# Altium schematic sheet concentrador.SchDoc: Diagrama_Concentrador V2.0
size A3; Date: 27/11/2018; DrawnBy: Franklin Placencia; Organization: Miviltech; SheetNumber: 1; PageSetup: Record=PageOptions|CenterHorizontal=True|CenterVertical=True|PrintScale=0.71|XCorrection=1.00|YCorrection=1.00|PrintKind=0|BorderSize=5000000|LeftOffset=0|BottomOffset=0|Orientation=2|PaperLength=1000|PaperWidth=1000|Scale=100|PaperSource=7|PrintQuality=-3|MediaType=1|DitherType=10|PrintScaleMode=1|PaperKind=A4 (210 x 297 mm)|PaperIndex=9
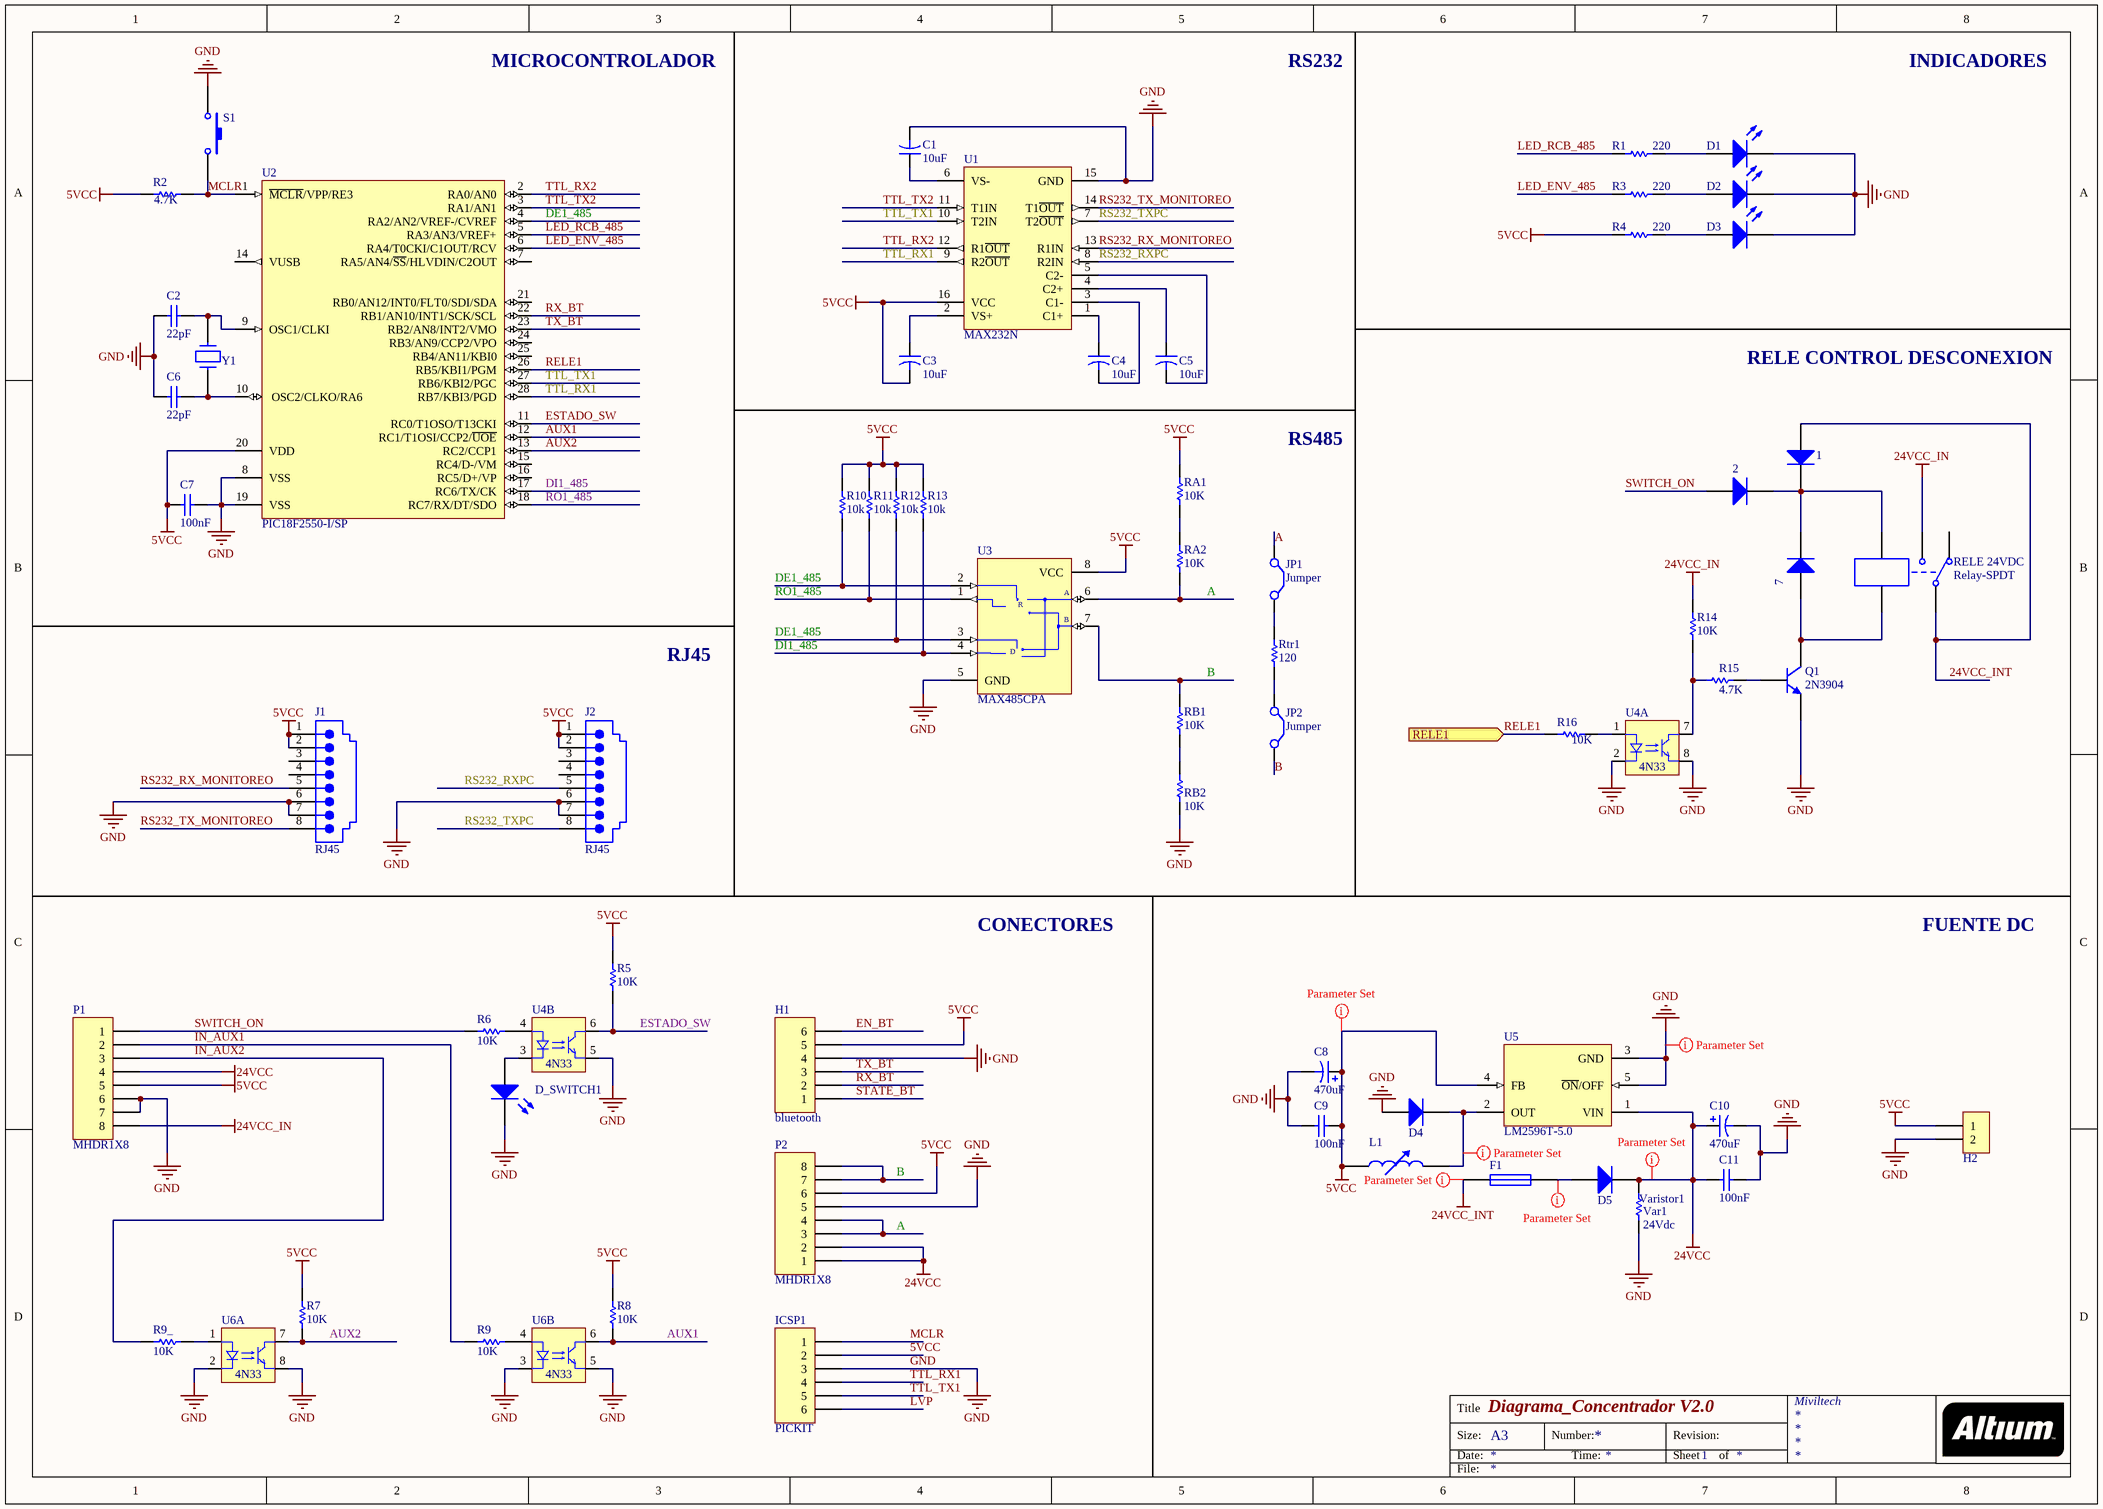
[diagram p0: concentrador.SchDoc]

## Parts
1  Diode 1N4001  [DIODE-0.3A]  (value not drawn)
2  Diode 1N4001  [DIODE-0.3A]  (value not drawn)
7  Diode 1N4001  [DIODE-0.3A]  (value not drawn)
C1  value 10uF  [C1UF]  (hidden comment: Cap2)
C2  value 22pF  [VP31-2.5]  (hidden comment: VP31BA220JB)
C3  value 10uF  [C1UF]  (hidden comment: Cap2)
C4  value 10uF  [C1UF]  (hidden comment: Cap2)
C5  value 10uF  [C1UF]  (hidden comment: Cap2)
C6  value 22pF  [VP31-2.5]  (hidden comment: VP31BA220JB)
C7  value 100nF  [VP44-2.5]  (hidden comment: VP44BY224JB)
C8  value 470uF  [C1000UF]  (hidden comment: Cap Pol1)
C9  value 100nF  [VP44-2.5]  (hidden comment: VP44BY224JB)
C10  value 470uF  [C1000UF]  (hidden comment: Cap Pol1)
C11  value 100nF  [VP44-2.5]  (hidden comment: VP44BY224JB)
D1  LED0  [LED3MM green]  (value not drawn)
D2  LED0  [LED3MM green]  (value not drawn)
D3  LED0  [LED3MM green]  (value not drawn)
D4  Diodo  [1N4000]  (value not drawn)
D5  Diodo  [1N4000]  (value not drawn)
D_SWITCH1  LED0  [LED3MM green]  (value not drawn)
F1  Fuse  [PORTA_FUSE]  (value not drawn)
H1  bluetooth  [Header 1X6]
H2  Header  [Header 1X2]  (value not drawn)
ICSP1  PICKIT  [HDR1X6]
J1  RJ45  [15-43-6233]
J2  RJ45  [15-43-6233]
JP1  Jumper  [RAD-0.2]
JP2  Jumper  [RAD-0.2]
L1  Inductor Adj  [Inductor_redondo]  (value not drawn)
P1  MHDR1X8  [8PEQ_TAIYUE_OK]
P2  MHDR1X8  [8PEQ_TAIYUE_OK]
Q1  2N3904  [2N3904_OK]
R1  value 220  [AXIAL-0.3]  (hidden comment: Res1)
R2  value 4.7K  [AXIAL-0.3]  (hidden comment: Res1)
R3  value 220  [AXIAL-0.3]  (hidden comment: Res1)
R4  value 220  [AXIAL-0.3]  (hidden comment: Res1)
R5  value 10K  [AXIAL-0.3]  (hidden comment: Res1)
R6  value 10K  [AXIAL-0.3]  (hidden comment: Res1)
R7  value 10K  [AXIAL-0.3]  (hidden comment: Res1)
R8  value 10K  [AXIAL-0.3]  (hidden comment: Res1)
R9  value 10K  [AXIAL-0.3]  (hidden comment: Res1)
R9_  value 10K  [AXIAL-0.3]  (hidden comment: Res1)
R10  value 10k  [AXIAL-0.3]  (hidden comment: Res1)
R11  value 10k  [AXIAL-0.3]  (hidden comment: Res1)
R12  value 10k  [AXIAL-0.3]  (hidden comment: Res1)
R13  value 10k  [AXIAL-0.3]  (hidden comment: Res1)
R14  value 10K  [AXIAL-0.3]  (hidden comment: Res1)
R15  value 4.7K  [AXIAL-0.3]  (hidden comment: Res1)
R16  value 10K  [AXIAL-0.3]  (hidden comment: Res1)
RA1  value 10K  [AXIAL-0.3]  (hidden comment: Res1)
RA2  value 10K  [AXIAL-0.3]  (hidden comment: Res1)
RB1  value 10K  [AXIAL-0.3]  (hidden comment: Res1)
RB2  value 10K  [AXIAL-0.3]  (hidden comment: Res1)
RELE_24VDC  Relay-SPDT  [MODULE5B]
Rtr1  value 120  [AXIAL-0.3]  (hidden comment: Res1)
S1  Push Button  [PULSA4]  (value not drawn)
U1  MAX232N  [N016]
U2  PIC18F2550-I/SP  [SPDIP300-SP28]
U3  MAX485CPA  [PA8]
U4  4N33  [4n35_4n33_6pines]  (parts A,B of 2)
U5  LM2596T-5.0  [FP_LM2596_D_PCB]
U6  4N33  [4n35_4n33_6pines]  (parts A,B of 2)
Varistor1  Var1  value 24Vdc  [AXIAL-0.3]
Y1  XTAL  [Cristal mini]  (value not drawn)

## Ports
RELE1 (in)

## Nets
5VCC: C3.2 C7.1 C8.1 C9.2 H1.5 H2.1 ICSP1.2 J1.1 J1.2 J2.1 J2.2 L1.1 P1.5 P2.6 R2.1 R4.1 R5.1 R7.1 R8.1 R10.2 R11.2 R12.2 R13.2 RA1.1 U1.16(VCC) U2.20(VDD) U3.8(VCC) U5.4(FB)
24VCC: C10.1 C11.1 D5.2(K) P1.4 P2.1 P2.2 U5.1(VIN) Varistor1.2
24VCC_IN: P1.8 R14.1 RELE_24VDC.3
24VCC_INT: 1.1(A) F1.2 RELE_24VDC.1
GND: C1.2 C2.2 C6.2 C7.2 C8.2 C9.1 C10.2 C11.2 D1.2(K) D2.2(K) D3.2(K) D4.1(A) D_SWITCH1.2(K) H1.4 H2.2 ICSP1.3 J1.6 J1.7 J2.6 J2.7 P1.6 P1.7 P2.5 Q1.1(E) RB2.1 S1.1 U1.15(GND) U2.8(VSS) U2.19(VSS) U3.5(GND) U4.2(K) U4.5(E) U4.8(E) U5.3(GND) U5.5(~{ON}/OFF) U6.2(K) U6.3(K) U6.5(E) U6.8(E) Varistor1.1
A: JP1.1(C1) P2.3 P2.4 RA2.1 U3.6(A)
AUX1: R8.2 U2.12(RC1/T1OSI/CCP2/~{UOE}) U6.6(C)
AUX2: R7.2 U2.13(RC2/CCP1) U6.7(C)
B: JP2.2(C2) P2.7 P2.8 RB1.1 U3.7(B)
DE1_485: R10.1 R12.1 U2.4(RA2/AN2/VREF-/CVREF) U3.2(~{RE}) U3.3(DE)
DI1_485: R13.1 U2.17(RC6/TX/CK) U3.4(DI)
EN_BT: H1.6
ESTADO_SW: R5.2 U2.11(RC0/T1OSO/T13CKI) U4.6(C)
IN_AUX1: P1.2 R9.2
IN_AUX2: P1.3 R9_.2
LED_ENV_485: R3.1 U2.6(RA4/T0CKI/C1OUT/RCV)
LED_RCB_485: R1.1 U2.5(RA3/AN3/VREF+)
LVP: ICSP1.6
MCLR: ICSP1.1 R2.2 S1.2 U2.1(~{MCLR}/VPP/RE3)
RELE1: R16.2 U2.26(RB5/KBI1/PGM) ; port RELE1
RO1_485: R11.1 U2.18(RC7/RX/DT/SDO) U3.1(RO)
RS232_RX_MONITOREO: J1.5 U1.13(R1IN)
RS232_RXPC: J2.5 U1.8(R2IN)
RS232_TX_MONITOREO: J1.8 U1.14(T1~{OUT})
RS232_TXPC: J2.8 U1.7(T2~{OUT})
RX_BT: H1.2 U2.22(RB1/AN10/INT1/SCK/SCL)
STATE_BT: H1.1
SWITCH_ON: 2.1(A) P1.1 R6.2
TTL_RX1: ICSP1.4 U1.9(R2~{OUT}) U2.28(RB7/KBI3/PGD)
TTL_RX2: U1.12(R1~{OUT}) U2.2(RA0/AN0)
TTL_TX1: ICSP1.5 U1.10(T2IN) U2.27(RB6/KBI2/PGC)
TTL_TX2: U1.11(T1IN) U2.3(RA1/AN1)
TX_BT: H1.3 U2.23(RB2/AN8/INT2/VMO)
Net1_2: 1.2(K) 2.2(K) 7.2(K) RELE_24VDC.5
Net7_1: 7.1(A) Q1.3(C) RELE_24VDC.4
NetC1_1: C1.1 U1.6(VS-)
NetC2_1: C2.1 U2.9(OSC1/CLKI) Y1.2
NetC3_1: C3.1 U1.2(VS+)
NetC4_1: C4.1 U1.1(C1+)
NetC4_2: C4.2 U1.3(C1-)
NetC5_1: C5.1 U1.4(C2+)
NetC5_2: C5.2 U1.5(C2-)
NetC6_1: C6.1 U2.10(OSC2/CLKO/RA6) Y1.1
NetD1_1: D1.1(A) R1.2
NetD2_1: D2.1(A) R3.2
NetD3_1: D3.1(A) R4.2
NetD4_2: D4.2(K) L1.2 U5.2(OUT)
NetD5_1: D5.1(A) F1.1
NetD_SWITCH1_1: D_SWITCH1.1(A) U4.3(K)
NetJP1_2: JP1.2(C2) Rtr1.2
NetJP2_1: JP2.1(C1) Rtr1.1
NetQ1_2: Q1.2(B) R15.2
NetR6_1: R6.1 U4.4(A)
NetR9_1: R9.1 U6.4(A)
NetR9__1: R9_.1 U6.1(A)
NetR14_2: R14.2 R15.1 U4.7(C)
NetR16_1: R16.1 U4.1(A)
NetRA1_2: RA1.2 RA2.2
NetRB1_2: RB1.2 RB2.2

Not connected (* = marked no-connect by the designer): J1 3 4; J2 3 4; RELE_24VDC 2; U2 7(RA5/AN4/~{SS}/HLVDIN/C2OUT) 14(VUSB) 15(RC4/D-/VM) 16(RC5/D+/VP) 21(RB0/AN12/INT0/FLT0/SDI/SDA) 24(RB3/AN9/CCP2/VPO) 25(RB4/AN11/KBI0)

## Layout directives
rule Width Constraint [Pref Width = 1.8mm    Min Width = 1.5mm    Max Width = 2.5mm]: 24VCC_INT, NetD4_2, NetD5_1
rule Width Constraint [Pref Width = 1mm    Min Width = 0.8mm    Max Width = 1.5mm]: 5VCC, GND
rule Width Constraint [Pref Width = 1.5mm    Min Width = 1.5mm    Max Width = 2.5mm]: 24VCC

## Notes on the sheet
- MICROCONTROLADOR
- RS232
- INDICADORES
- RELE CONTROL DESCONEXION
- RS485
- RJ45
- CONECTORES
- FUENTE DC
- Title
- Size:
- Date:
- A3
- Number:
- Time:
- Revision:
- Sheet
- of
- File:
- (in symbol MAX485CPA) R; D

## Library data of the parts
1 2 7 = Diode 1N4001: 1 Amp General Purpose Rectifier; Published: 8-Jun-2000; LatestRevisionDate: 17-Jul-2002; LatestRevisionNote: Re-released for DXP Platform.; DatasheetVersion: 1998; PackageVersion: Aug-1999; PackageReference: DO-41; Publisher: Altium Limited; Code_JEDEC: DO-204-AL; ComponentLink1Description: Manufacturer Link; ComponentLink1URL: http://www.fairchildsemi.com/; ComponentLink2Description: Datasheet; ComponentLink2URL: http://www.fairchildsemi.com/ds/1N%2F1N4001.pdf; PackageDescription: Diode, Axial; Body 5.2 x 2.7 mm (LxDia. max), Lead Dia. 0.86 mm (max)
C1 C3-C5 = Cap2: Capacitor; Published: 23-Sep-2002; PackageReference: CAPR5-4X5; Publisher: Altium Limited; PackageDescription: Capacitor; 2 Leads
C2 C6 = VP31BA220JB: Dipped Radial Multilayer Ceramic Capacitor COG (NPO): 22pF, 100V; Note: See Datasheet for other packages & tolerances; Published: 17-Dec-2003; DatasheetDocument: 2-Jan-2002; PackageDocument: 8-Feb-2002; PackageReference: VP31-2.5; Publisher: Altium Limited; ComponentLink1Description: Manufacturer Link; ComponentLink1URL: http://www.vishay.com/
C7 C9 C11 = VP44BY224JB: Dipped Radial Multilayer Ceramic Capacitor X7R: 220nF, 100V; Published: 17-Dec-2003; DatasheetDocument: 4-Feb-2002; PackageDocument: 4-Feb-2002; PackageReference: VP44-2.5; Publisher: Altium Limited; ComponentLink1Description: Manufacturer Link; ComponentLink1URL: http://www.vishay.com/
C8 C10 = Cap Pol1: Polarized Capacitor (Radial); Published: 8-Jun-2000; LatestRevisionDate: 17-Jul-2002; LatestRevisionNote: Re-released for DXP Platform.; PackageReference: RB7.6-15; Publisher: Altium Limited
D1-D3 D_SWITCH1 = LED0: Typical INFRARED GaAs LED; Published: 8-Jun-2000; LatestRevisionDate: 08-Jul-2005; LatestRevisionNote: Mech Layer 1 removed.; PackageReference: LED-0; Publisher: Altium Limited; PackageDescription: LED; 2 Leads
D4 D5 = Diodo: Diodo rectificador
F1 = Fuse 1: Published: 8-Jun-2000; LatestRevisionDate: 17-Jul-2002; LatestRevisionNote: Re-released for DXP Platform.; PackageReference: PIN-W2/E2.8; Publisher: Altium Limited; PackageDescription: Thru-Hole; 2 Leads
H1 ICSP1 = Header 6: Header, 6-Pin; LatestRevisionDate: 17-Jul-2002; LatestRevisionNote: Re-released for DXP Platform.; Publisher: Altium Limited
H2 = Header 2: Header 2 pin
J1 J2 = 15-43-6233: Right Angle, Standard Profile, RJ45-Keyed, Flange Mount PCB Jack; Ports: 1; Positions/Loaded: Port1 - 8 Keyed/8; PerformanceCategory: 3; PCB_Mounting: Thru-Hole; ComponentAvailability: Obsolete; DrillSize: Nominal, Rounded to nearest 0.05mm; PCB_Layout: Complies with Manufacturer's Recommendation.; Published: 25-Jun-2002; DatasheetDocument: 18-Dec-2001; PackageDocument: 18-Dec-2001; PackageReference: 15-43-6233; Publisher: Altium Limited; ComponentLink1Description: Manufacturer Link; ComponentLink1URL: http://www.molex.com/; ComponentLink2Description: Datasheet; ComponentLink2URL: http://www.molex.com/cmc_upload/common_files/1212003_catalogmx41314.pdf; ComponentLink3Description: Iges Model; ComponentLink3URL: http://www.molex.com/pdm_docs/igs/15-43-6233_igs.zip
JP1 JP2 = Jumper: Jumper Wire; Published: 24-Mar-1999; LatestRevisionDate: 17-Jul-2002; LatestRevisionNote: Re-released for DXP Platform.; PackageReference: RAD-0.2; Publisher: Altium Limited; PackageDescription: Radial Cap, Thru-Hole; 2 Leads; 0.2 in Pin Spacing
L1 = Inductor Adj: Adjustable Inductor; Value: 10mH; Set Position: 0.5; Published: 24-Mar-1999; LatestRevisionDate: 17-Jul-2002; LatestRevisionNote: Re-released for DXP Platform.; PackageReference: AXIAL-0.8; Publisher: Altium Limited
P1 P2 = MHDR1X8: Header, 8-Pin; LatestRevisionDate: 17-Jul-2002; LatestRevisionNote: Re-released for DXP Platform.; Publisher: Altium Limited
Q1 = 2N3904: NPN General Purpose Amplifier; Published: 8-Jun-2000; LatestRevisionDate: 15-Jan-2003; LatestRevisionNote: PCB Footprint 'BCY-W3/D4.7' replaced; DatasheetVersion: 1997; PackageVersion: Sep-1998; PackageReference: TO-92A; Publisher: Altium Limited; PackageDescription: TO, Flat Index; 3 In-Line, Axial Leads; Body Dia. 4.5mm; Leads 0.51 x 0.48 mm (max); ComponentLink1Description: Manufacturer Link; ComponentLink1URL: http://www.fairchildsemi.com/; ComponentLink2Description: Datasheet; ComponentLink2URL: http://www.fairchildsemi.com/ds/2N%2F2N3904.pdf
R1-R9 R9_ R10-R16 RA1 RA2 RB1 RB2 Rtr1 Varistor1 = Res1: Resistor; Published: 8-Jun-2000; LatestRevisionDate: 17-Jul-2002; LatestRevisionNote: Re-released for DXP Platform.; PackageReference: AXIAL-0.3; Publisher: Altium Limited; PackageDescription: Axial Device, Thru-Hole; 2 Leads; 0.3 in Pin Spacing
RELE_24VDC = Relay-SPDT: Single-Pole Dual-Throw Relay; Published: 24-Mar-1999; LatestRevisionDate: 17-Jul-2002; LatestRevisionNote: Re-released for DXP Platform.; PackageReference: MODULE5B; Publisher: Altium Limited
S1 = Push Button: Switch; Published: 24-Mar-1999; LatestRevisionDate: 17-Jul-2002; LatestRevisionNote: Re-released for DXP Platform.; PackageReference: SPST-2; Publisher: Altium Limited
U1 = MAX232N: Dual EIA-232 Driver/Receiver; Note: Receivers have typical hysteresis of 0.5V; Published: 15-May-2002; LatestRevisionDate: 04-Mar-2005; LatestRevisionNote: Stylized 3D Model Added.; DatasheetVersion: Jun-1989; PackageVersion: Oct-1995; PackageReference: N016; Publisher: Altium Limited; PackageDescription: DIP; 16 Leads; Row Spacing 7.62 mm; Pitch 2.54 mm; Code_JEDEC: MS-001-BB; ComponentLink1Description: Manufacturer Link; ComponentLink1URL: http://www.ti.com/; ComponentLink2Description: Datasheet; ComponentLink2URL: http://www-s.ti.com/sc/ds/max232.pdf
U2 = PIC18F2550-I/SP: High Performance, Enhanced Flash, USB Microcontroller with nanoWatt Technology, 32K Flash, 28-Pin SPDIP, Industrial Temperature Range; Published: 29-Jan-2009; LatestRevisionDate: 02-Dec-2009; LatestRevisionNote: Updated to datasheet revision E, Aug-2008; DatasheetVersion: revE, Aug-2008; PackageVersion: revBB, Aug-2009; PackageReference: SPDIP300-SP28; Publisher: Altium Limited; PackageDescription: 28-Lead Skinny Plastic Dual In-Line (SP) - 300 mil Body [SPDIP]; Supplier 1: Digi-Key; Supplier Part Number 1: PIC18F2550-I/SP-ND; Supplier 2: Farnell; Supplier Part Number 2: 9321250; Supplier 3: Farnell; Supplier Part Number 3: 1523822; ComponentLink1Description: Datasheet; ComponentLink1URL: http://ww1.microchip.com/downloads/en/DeviceDoc/39632e.pdf; ComponentLink2Description: Packaging Specification; ComponentLink2URL: http://www.microchip.com/stellent/groups/techpub_sg/documents/packagingspec/en012702.pdf; ComponentLink3Description: Microchip.com Home; ComponentLink3URL: http://www.microchip.com/
U3 = MAX485CPA: Low-Power, Slew-Rate-Limited RS-485/RS-422 Transceiver; Published: 16-Jan-2001; LatestRevisionDate: 29-May-2009; LatestRevisionNote: Component Body Added.; DatasheetVersion: Feb-1996; PackageVersion: RevB, 21-0043; PackageReference: PA8; Publisher: Altium Limited; PackageDescription: DIP, 8-Pin, Row Spacing 7.62 mm, Pitch 2.54 mm; Code_JEDEC: MS-001-AB; ComponentLink1Description: Manufacturer Link; ComponentLink1URL: http://www.maxim-ic.com/; ComponentLink2Description: Datasheet; ComponentLink2URL: http://pdfserv.maxim-ic.com/en/ds/MAX1487-MAX491.pdf
U4 U6 = ILD74: Optocoupler, Phototransistor Output, Dual Channel, TTL Compatible, Pb-free; Note: Coupling Capacitance, 0.5 pF; Note: Transfer Ratio, 35 % Typical; Published: 6-Oct-2005; DatasheetDocument: Rev. 1.4, Oct-2004; PackageDocument: Dec-2003; PackageReference: DIP8; Publisher: Altium Limited; ComponentLink1Description: Manufacturer Link; ComponentLink1URL: http://www.vishay.com/optocouplers/list/product-83640/; ComponentLink2Description: Datasheet; ComponentLink2URL: http://www.vishay.com/docs/83640/83640.pdf
U5 = LM2596T-5.0: SIMPLE SWITCHER Power Converter 150 KHz 3A Step-Down Voltage Regulator; Manufacturer: National Semiconductor; PackageTopMarking: NSUZXYTT*LM2596T*-5.0 P+; PowerWise: N; FirstPublished: 4-Dec-2008; DatasheetVersion: May-2002; PackageVersion: revA, Oct-1989; PackageReference: T05D; Publisher: Altium Limited; PackageDescription: TO-220, Molded, Stagger Bend, 5 Lead; CompType: Switcher; PartNumber: LM2596T-5.0; RoHS: O; PinCount: 5; DigiKeyPartNumber: LM2596T-5.0-ND; ComponentLink1Description: LM2596 Datasheet; ComponentLink1URL: http://www.national.com/ds/LM/LM2596.pdf; ComponentLink2Description: LM2596 Web Page; ComponentLink2URL: http://www.national.com/pf/LM/LM2596.html; ComponentLink3Description: T05D Package Page; ComponentLink3URL: http://www.national.com/packaging/folders/t05d.html
Y1 = Cristal de cuarzo